# EAGLE design Schematic_1 (EAGLE 9.6.2)
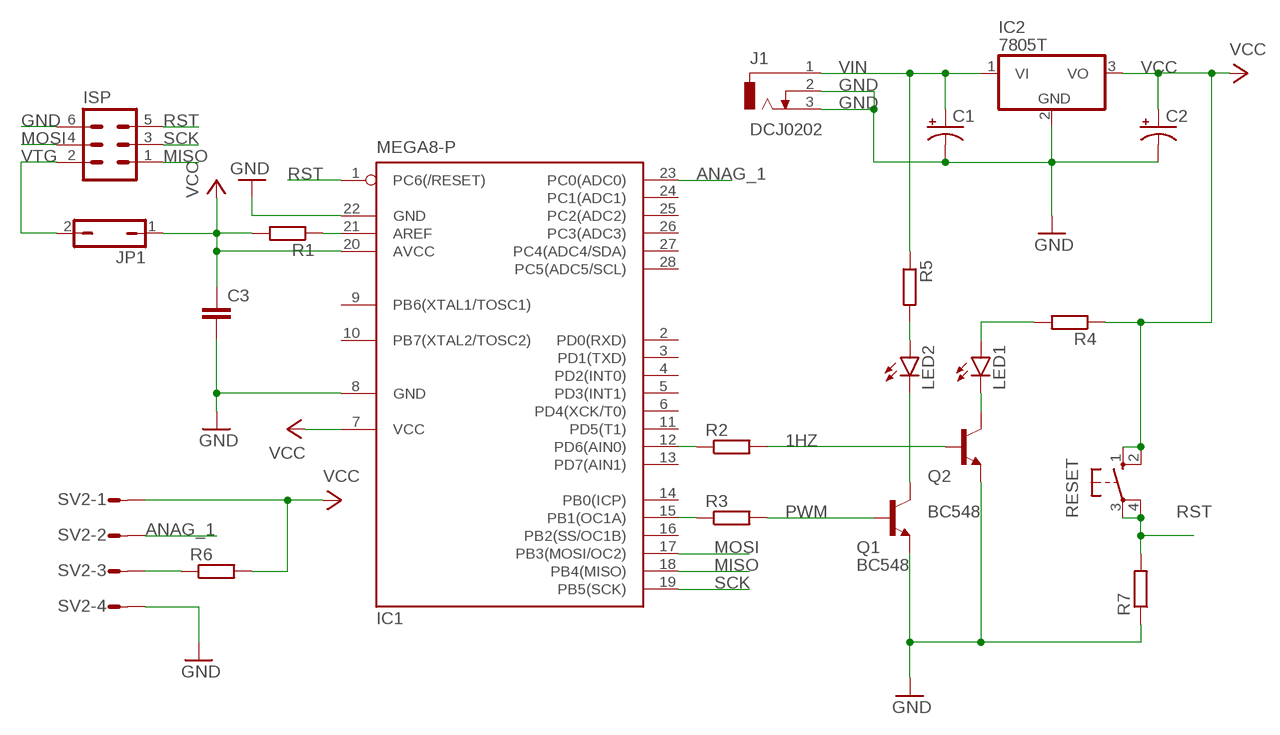
[diagram p0: schematic, sheet 1]

## Parts
C1  CPOL-USE2.5-7  [E2,5-7]
C2  CPOL-USE2.5-7  [E2,5-7]
C3  C-EU025-025X050  [C025-025X050]
IC1  MEGA8-P  [DIL28-3]
IC2  7805T  [TO220H]
ISP  ML6  [ML6]
J1  DCJ0202  [DCJ0202]
JP1  JP1Q  [JP1]
LED1  LEDB156  [Q62902-B156]
LED2  LEDB156  [Q62902-B156]
Q1  BC548  [TO92-EBC]
Q2  BC548  [TO92-EBC]
R1  R-EU_0207/7  [0207/7]
R2  R-EU_0207/7  [0207/7]
R3  R-EU_0207/7  [0207/7]
R4  R-EU_0207/7  [0207/7]
R5  R-EU_0207/7  [0207/7]
R6  R-EU_0207/7  [0207/7]
R7  R-EU_0207/7  [0207/7]
RESET  10-XX  [B3F-10XX]
SV2  L04P  [L04P]

## Nets
1HZ: Q2.B R2.2
ANAG_1: IC1.23(PC0(ADC0)) SV2.2
GND: C1.- C2.- C3.2 IC1.8(GND) IC1.22(GND) IC2.2(GND) ISP.6 J1.2 J1.3 Q1.E Q2.E R7.1 SV2.4
MISO: IC1.18(PB4(MISO)) ISP.1
MOSI: IC1.17(PB3(MOSI/OC2)) ISP.4
N$1: IC1.21(AREF) R1.1
N$2: IC1.15(PB1(OC1A)) R3.1
N$3: IC1.12(PD6(AIN0)) R2.1
N$4: R6.1 SV2.3
N$5: LED2.K(C) Q1.C
N$6: LED2.A R5.2
N$7: LED1.A R4.2
N$8: LED1.K(C) Q2.C
PWM: Q1.B R3.2
RST: IC1.1(PC6(/RESET)) ISP.5 R7.2 RESET.3(P) RESET.4(P1)
SCK: IC1.19(PB5(SCK)) ISP.3
VCC: C2.+ C3.1 IC1.7(VCC) IC1.20(AVCC) IC2.3(VO) JP1.1 R1.2 R4.1 R6.2 RESET.1(S) RESET.2(S1) SV2.1
VIN: C1.+ IC2.1(VI) J1.1 R5.1
VTG: ISP.2 JP1.2
Unconnected: IC1.2(PD0(RXD)) IC1.3(PD1(TXD)) IC1.4(PD2(INT0)) IC1.5(PD3(INT1)) IC1.6(PD4(XCK/T0)) IC1.9(PB6(XTAL1/TOSC1)) IC1.10(PB7(XTAL2/TOSC2)) IC1.11(PD5(T1)) IC1.13(PD7(AIN1)) IC1.14(PB0(ICP)) IC1.16(PB2(SS/OC1B)) IC1.24(PC1(ADC1)) IC1.25(PC2(ADC2)) IC1.26(PC3(ADC3)) IC1.27(PC4(ADC4/SDA)) IC1.28(PC5(ADC5/SCL))

## Library data of the parts
C1 C2 = rcl:CPOL-US: POLARIZED CAPACITOR, American symbol; SPICEPREFIX: C
C3 = rcl:C-EU: CAPACITOR, European symbol; SPICEPREFIX: C
IC1 = atmel:MEGA8-P: MICROCONTROLLER 8 Kbytes FLASH, 1 kbytes SRAM, 512 bytes EEPROM, USART, 4-channel 10 bit ADC, 2-channel 8 bit ADC Pin compatible with Atmega48, ATMega88, ATMega168 Source: avr.lbr; OC_FARNELL: unknown; OC_NEWARK: unknown
IC2 = linear:78*: Positive VOLTAGE REGULATOR Source: http://cache.national.com/ds/LM/LM78L05.pdf http://www.fairchildsemi.com/ds/LM/LM7805.pdf
ISP = con-ml:ML6: HARTING; OC_FARNELL: unknown; OC_NEWARK: unknown
J1 = con-jack:DCJ0202: DC POWER JACK Source: DCJ0202.pdf; OC_FARNELL: unknown; OC_NEWARK: unknown
JP1 = jumper:JP1Q: JUMPER
LED1 LED2 = led:LED: LED OSRAM: - CHIPLED LG R971, LG N971, LY N971, LG Q971, LY Q971, LO R971, LY R971 LH N974, LH R974 LS Q976, LO Q976, LY Q976 LO Q996 - Hyper CHIPLED LW Q18S LB Q993, LB Q99A, LB R99A - SideLED LS A670, LO A670, LY A670, LG A670, LP A670 LB A673, LV A673, LT A673, LW A673 LH A674 LY A675 LS A676, LA A676, LO A676, LY A676, LW A676 LS A679, LY A679, LG A679 - Hyper Micro SIDELED® LS Y876, LA Y876, LO Y876, LY Y876 LT Y87S - SmartLED LW L88C, LW L88S LB L89C, LB L89S, LG L890 LS L89K, LO L89K, LY L89K LS L896, LA L896, LO L896, LY L896 - TOPLED LS T670, LO T670, LY T670, LG T670, LP T670 LSG T670, LSP T670, LSY T670, LOP T670, LYG T670 LG T671, LOG T671, LSG T671 LB T673, LV T673, LT T673, LW T673 LH T674 LS T676, LA T676, LO T676, LY T676, LB T676, LH T676, LSB T676, LW T676 LB T67C, LV T67C, LT T67C, LS T67K, LO T67K, LY T67K, LW E67C LS E67B, LA E67B, LO E67B, LY E67B, LB E67C, LV E67C, LT E67C LW T67C LS T679, LY T679, LG T679 LS T770, LO T770, LY T770, LG T770, LP T770 LB T773, LV T773, LT T773, LW T773 LH T774 LS E675, LA E675, LY E675, LS T675 LS T776, LA T776, LO T776, LY T776, LB T776 LHGB T686 LT T68C, LB T68C - Hyper Mini TOPLED® LB M676 - Mini TOPLED Santana® LG M470 LS M47K, LO M47K, LY M47K Source: http://www.osram.convergy.de LUXEON: - LUMILED® LXK2-PW12-R00, LXK2-PW12-S00, LXK2-PW14-U00, LXK2-PW14-V00 LXK2-PM12-R00, LXK2-PM12-S00, LXK2-PM14-U00 LXK2-PE12-Q00, LXK2-PE12-R00, LXK2-PE12-S00, LXK2-PE14-T00, LXK2-PE14-U00 LXK2-PB12-K00, LXK2-PB12-L00, LXK2-PB12-M00, LXK2-PB14-N00, LXK2-PB14-P00, LXK2-PB14-Q00 LXK2-PR12-L00, LXK2-PR12-M00, LXK2-PR14-Q00, LXK2-PR14-R00 LXK2-PD12-Q00, LXK2-PD12-R00, LXK2-PD12-S00 LXK2-PH12-R00, LXK2-PH12-S00 LXK2-PL12-P00, LXK2-PL12-Q00, LXK2-PL12-R00 Source: www.luxeon.com KINGBRIGHT: KA-3528ASYC Source: www.kingbright.com
Q1 Q2 = transistor-npn:BC548*: NPN Transistor
R1-R7 = rcl:R-EU_: RESISTOR, European symbol; SPICEPREFIX: R
RESET = switch-omron:10-XX: OMRON SWITCH; MPN: B3F-1000; OC_FARNELL: 176432; OC_NEWARK: 36M3542
SV2 = con-amp-mt:L04P: AMP MT CONNECTOR; OC_FARNELL: unknown; OC_NEWARK: unknown

## Board
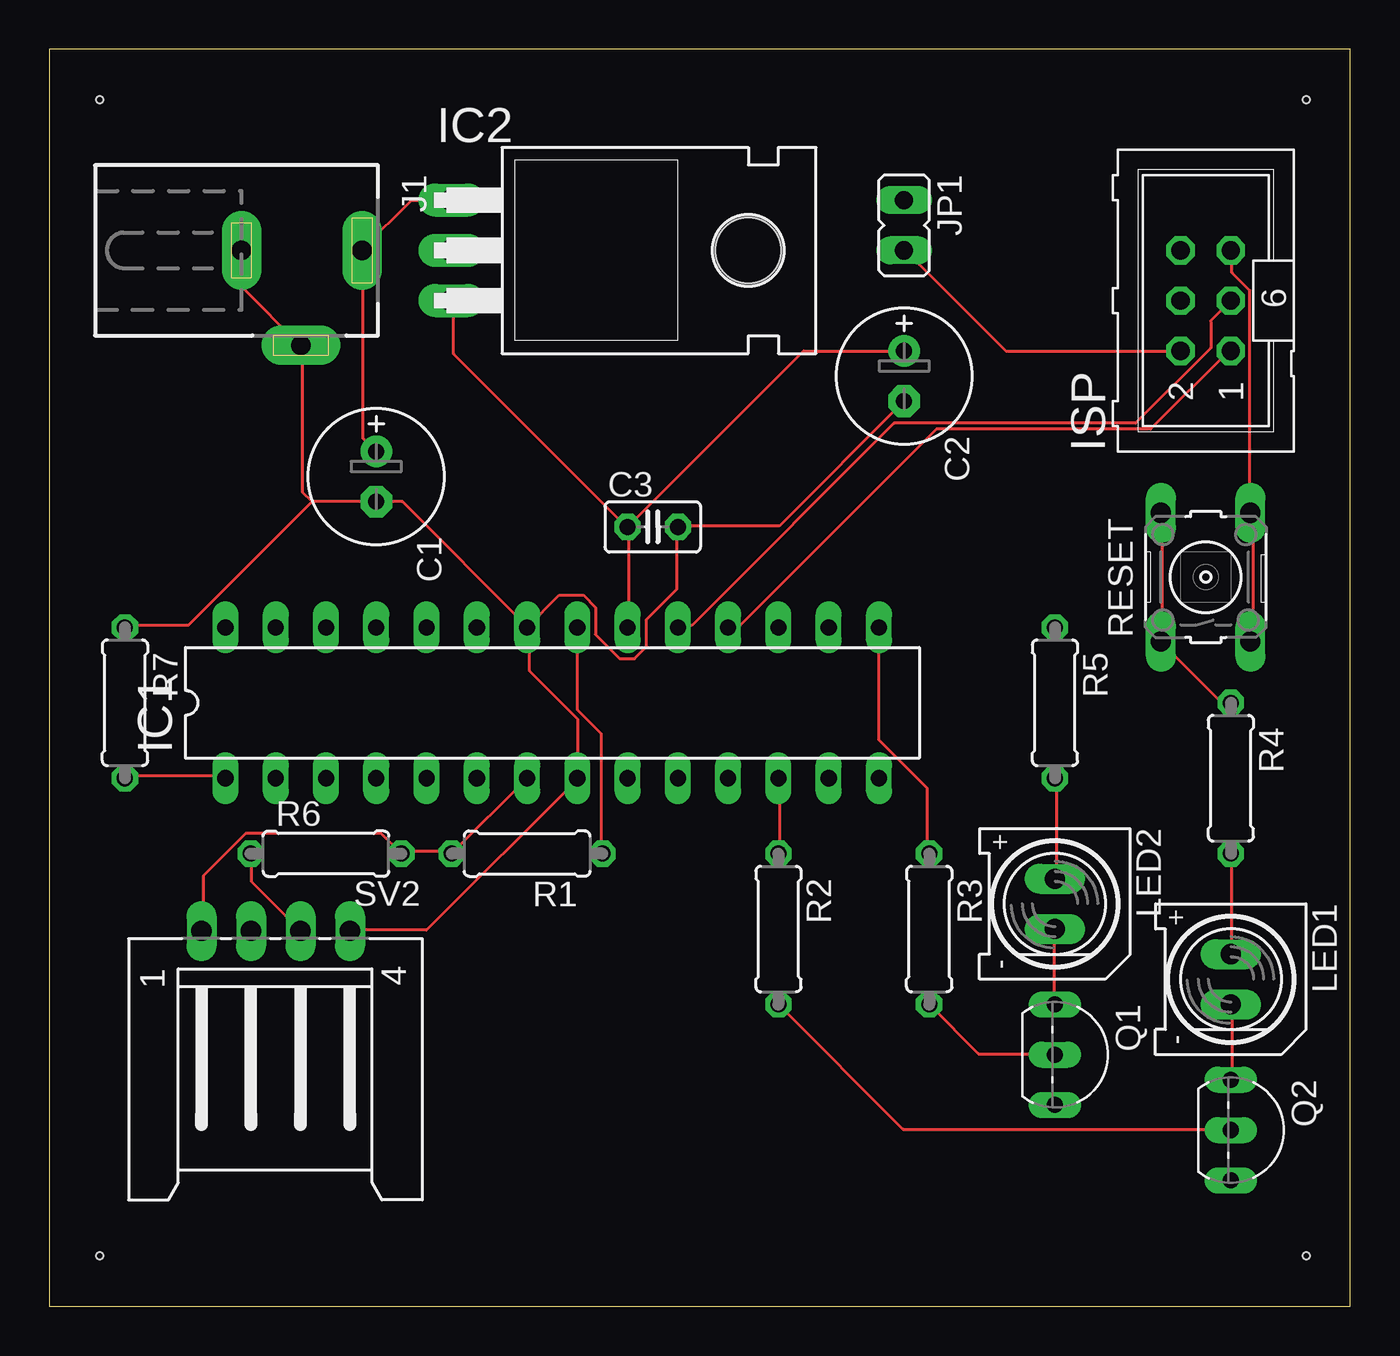
[diagram p1: board, top side]
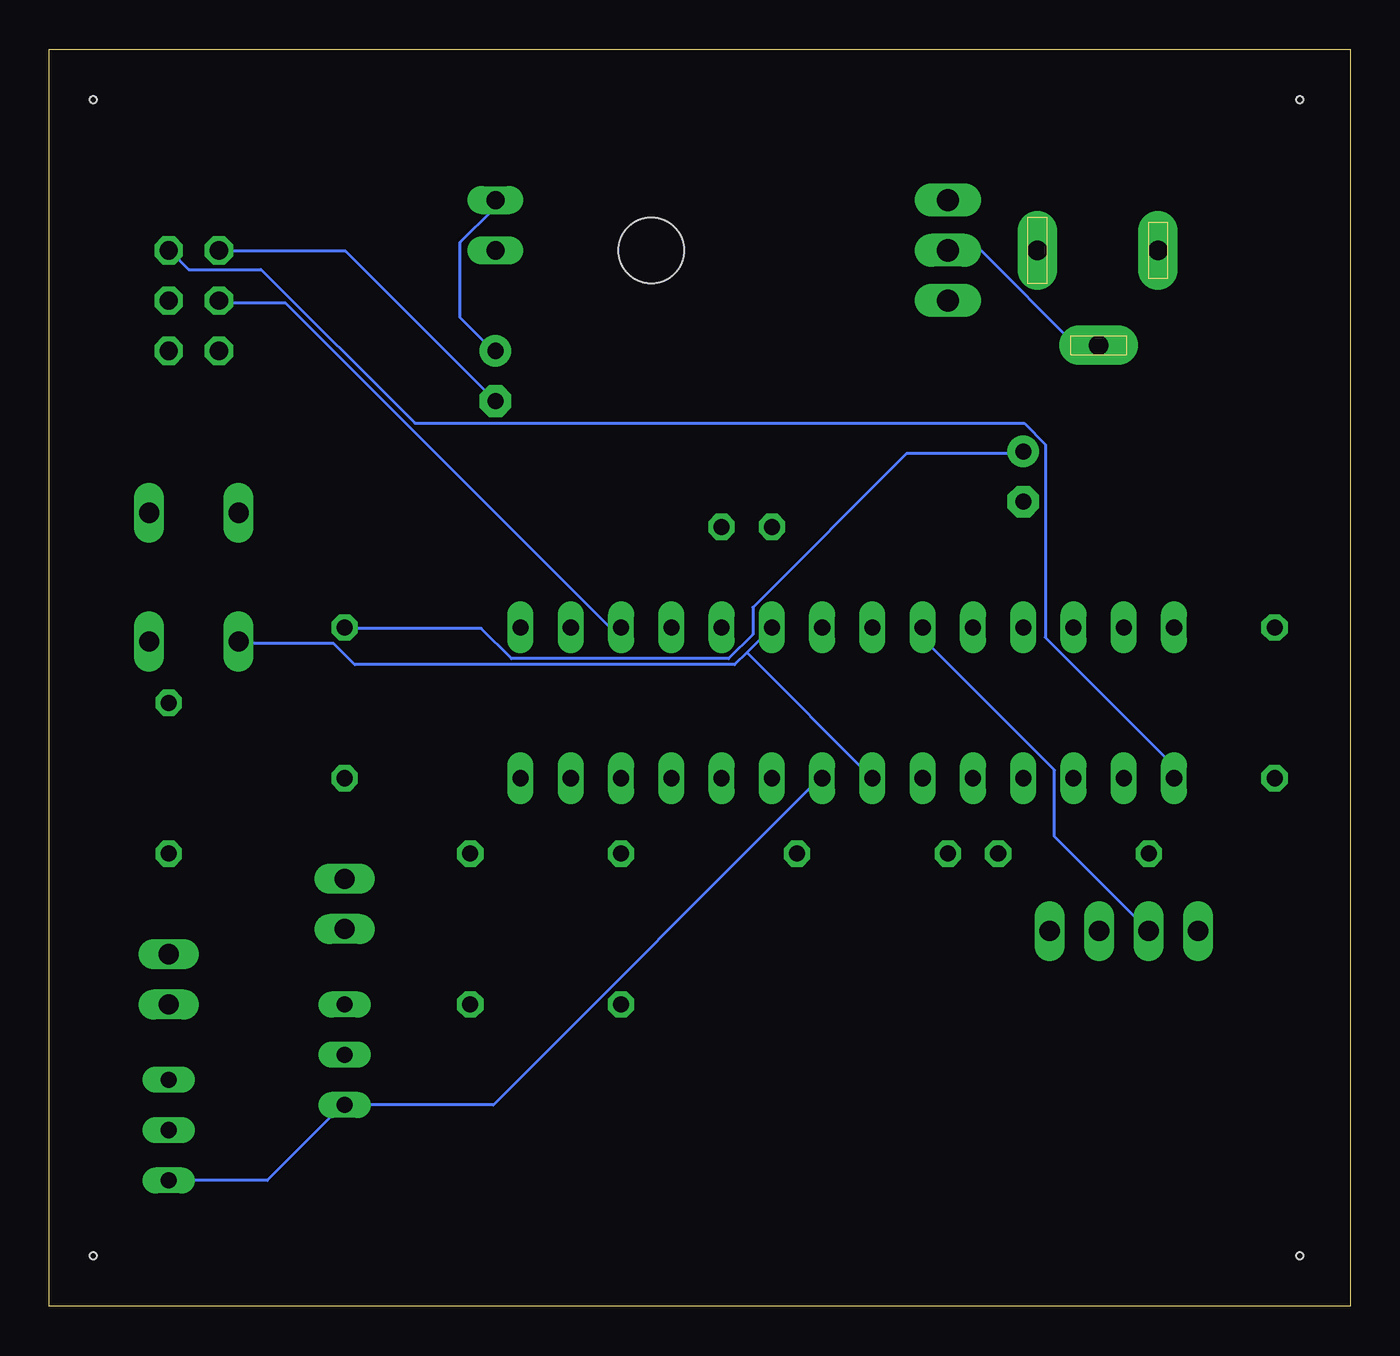
[diagram p2: board, bottom side, seen from below]

Size 65.71 x 63.49 mm. Coordinates in mm from the lower left corner, seen from the top.
Outline: 0,0 65.71,0 65.71,63.49 0,63.49 0,0
Copper layers (1*16): Top 0.035mm / dielectric 1.5mm / Bottom 0.035mm
Design rules "default": minimum track width 6mil, minimum drill 0.35mm, track to track 6mil, track to pad 6mil, pad to pad 6mil, via to via 6mil, smd to smd 6mil, copper to edge 40mil, drill to drill 6mil, minimum pad ring 10mil, minimum via ring 8mil, stop-mask expansion 4mil, vias tented up to drill 0mil, thermal gap 10mil
Holes 0.35 mm at 2.54,60.96 2.54,2.54 63.5,60.96 63.5,2.54

### Footprints (pad centres in the part's own frame; a part is rotated, then mirrored left to right if it is on the bottom)
E2,5-7 = drill 0.813 pad 1.6: + -1.27,0 | drill 0.813 pad 1.6 octagon: - 1.27,0
C025-025X050 = drill 0.813 octagon: 1 -1.27,0; 2 1.27,0
DIL28-3 = drill 0.813 long: 1 -16.51,-3.81; 2 -13.97,-3.81; 3 -11.43,-3.81; 4 -8.89,-3.81; 5 -6.35,-3.81; 6 -3.81,-3.81; 7 -1.27,-3.81; 8 1.27,-3.81; 9 3.81,-3.81; 10 6.35,-3.81; 11 8.89,-3.81; 12 11.43,-3.81; 13 13.97,-3.81; 14 16.51,-3.81; 15 16.51,3.81; 16 13.97,3.81; 17 11.43,3.81; 18 8.89,3.81; 19 6.35,3.81; 20 3.81,3.81; 21 1.27,3.81; 22 -1.27,3.81; 23 -3.81,3.81; 24 -6.35,3.81; 25 -8.89,3.81; 26 -11.43,3.81; 27 -13.97,3.81; 28 -16.51,3.81
TO220H = drill 1.118 long: 1 -2.54,-10.16; 2 0,-10.16; 3 2.54,-10.16 | hole 3.302: 0,4.826
ML6 = drill 0.914 octagon: 1 -2.54,-1.27; 2 -2.54,1.27; 3 0,-1.27; 4 0,1.27; 5 2.54,-1.27; 6 2.54,1.27
DCJ0202 = drill 1 pad 2 long: 1 0,3.1; 2 4.8,0; 3 0,-3
JP1 = drill 0.914 long: 1 0,-1.27; 2 0,1.27
Q62902-B156 = drill 1.016 long: A -1.27,0; K 1.27,0
TO92-EBC = drill 0.813 long: B 0,-1.27; C -2.54,-1.27; E 2.54,-1.27
0207/7 = drill 0.813 octagon: 1 -3.81,0; 2 3.81,0
B3F-10XX = drill 1.016 long: 1 -3.251,2.261; 2 3.251,2.261; 3 -3.251,-2.261; 4 3.251,-2.261
L04P = drill 1.016 long: 1 3.75,-6.25; 2 1.25,-6.25; 3 -1.25,-6.25; 4 -3.75,-6.25

### Placement (x,y rotation side)
C1  16.51,41.91 270 top
C2  43.18,46.99 270 top
C3  30.48,39.37 0 top
IC1  25.4,30.48 0 top
IC2  30.48,53.34 270 top
ISP  58.42,50.8 90 top
J1  12.7,53.34 270 top
JP1  43.18,54.61 180 top
LED1  59.69,16.51 270 top
LED2  50.8,20.32 270 top
Q1  52.07,12.7 270 top
Q2  60.96,8.89 270 top
R1  24.13,22.86 180 top
R2  36.83,19.05 270 top
R3  44.45,19.05 270 top
R4  59.69,26.67 270 top
R5  50.8,30.48 270 top
R6  13.97,22.86 0 top
R7  3.81,30.48 270 top
RESET  58.42,36.83 90 top
SV2  11.43,12.7 180 top

### Tracks (layer width: path | path; a pad name or v marks a point on that pad's centre or on a via)
1HZ
  Top 0.152: R2.2 43.13,8.94 59.59,8.94 Q2.B
ANAG_1
  Bottom 0.152: IC1.23 21.49,34.24 21.49,33.63 14.94,27.08 14.94,23.72 10.21,19 SV2.2
GND
  Top 0.152: C2.- 36.88,39.42 31.85,39.42 C3.2 31.7,39.27 31.7,36.22 30.18,34.7 30.18,33.33 29.57,32.72 28.8,32.72 27.58,33.93 27.58,35.31 26.98,35.92 25.76,35.92 IC1.22 | J1.3 9.75,53.29 9.75,51.46 12.65,48.56 J1.2 12.8,48.41 12.8,41.1 13.26,40.64 | 13.26,40.64 7.01,34.39 3.81,34.39 R7.1 | 13.26,40.64 C1.- 17.83,40.64 24.08,34.39 IC1.22 | IC1.22 24.23,34.24 24.23,32.11 26.67,29.67 IC1.8 26.67,26.62 19.05,19 15.24,19 SV2.4
  Bottom 0.152: C2.- 50.75,53.29 57.15,53.29 ISP.6 | IC2.2 20.27,53.29 18.59,53.29 13.87,48.56 12.8,48.56 J1.2 | Q2.E 54.71,6.35 50.9,10.16 Q1.E 43.28,10.16 26.67,26.77 IC1.8
MISO
  Top 0.152: IC1.18 34.29,34.39 34.9,34.39 44.81,44.3 55.63,44.3 59.59,48.26 ISP.1
MOSI
  Bottom 0.152: IC1.17 36.88,34.39 37.49,34.39 53.8,50.7 57.15,50.7 ISP.4
N$1
  Top 0.152: IC1.21 26.67,30.12 27.89,28.9 27.89,22.96 R1.1
N$2
  Top 0.152: IC1.15 41.91,28.6 44.35,26.16 44.35,22.96 R3.1
N$3
  Top 0.152: R2.1 36.88,22.96 36.88,26.62 IC1.12
N$4
  Top 0.152: R6.1 10.21,22.81 10.21,21.44 12.65,19 SV2.3
N$5
  Top 0.152: Q1.C 50.75,15.34 50.75,19 LED2.K
N$6
  Top 0.152: R5.2 50.9,26.62 50.9,21.59 LED2.A
N$7
  Top 0.152: R4.2 59.74,22.81 59.74,17.78 LED1.A
N$8
  Top 0.152: Q2.C 59.74,11.53 59.74,15.19 LED1.K
PWM
  Top 0.152: R3.2 46.94,12.75 50.75,12.75 Q1.B
RST
  Top 0.152: R7.2 3.81,26.77 8.84,26.77 IC1.1 | ISP.5 59.74,53.29 59.74,52.22 60.66,51.31 60.66,40.18 RESET.4 60.81,40.03 60.81,33.63 RESET.3
  Bottom 0.152: IC1.1 8.99,26.77 8.99,27.38 15.39,33.78 15.39,43.54 16.46,44.6 47.24,44.6 55.02,52.38 58.67,52.38 59.59,53.29 ISP.5
SCK
  Top 0.152: ISP.3 58.67,49.78 58.67,48.41 54.86,44.6 42.67,44.6 32.46,34.39 31.85,34.39 IC1.19
VCC
  Top 0.152: IC1.7 R1.2 20.27,22.96 17.83,22.96 R6.2 16.76,23.88 9.91,23.88 7.77,21.74 7.77,19 SV2.1 | R4.1 59.59,30.58 59.13,30.58 56.24,33.48 RESET.1 56.24,33.63 56.24,40.03 RESET.2 | IC1.20 29.26,34.39 29.26,39.27 C3.1 | IC2.3 20.42,50.7 20.42,48.11 29.11,39.42 C3.1 | C2.+ 38.1,48.26 C3.1
  Bottom 0.152: JP1.1 43.28,55.88 43.28,55.42 44.96,53.75 44.96,49.94 43.28,48.26 C2.+ | IC1.20 30.48,33.02 | 30.48,33.02 31.09,32.41 50.29,32.41 51.36,33.48 56.08,33.48 RESET.1 | 30.48,33.02 IC1.7
VIN
  Top 0.152: IC2.1 18.29,55.88 15.85,53.44 J1.1 15.85,53.29 15.85,43.84 C1.+
  Bottom 0.152: R5.1 50.75,34.24 43.89,34.24 42.37,32.72 31.39,32.72 30.18,33.93 30.18,35.31 22.4,43.08 16.61,43.08 C1.+
VTG
  Top 0.152: ISP.2 48.31,48.26 43.28,53.29 JP1.2